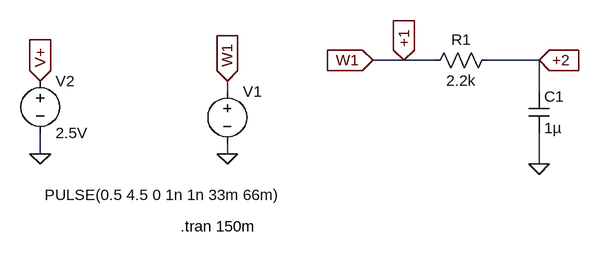
[diagram p0: schematic transient_response_RC_series.asc]
transient_response_RC_series.asc, the LTspice schematic file:
Version 4
SHEET 1 880 680
WIRE 128 112 80 112
WIRE 176 112 128 112
WIRE 336 112 256 112
WIRE -144 160 -144 144
WIRE 336 160 336 112
WIRE -432 256 -432 224
WIRE -144 256 -144 240
WIRE 336 272 336 224
FLAG -144 256 0
FLAG -144 144 W1
IOPIN -144 144 In
FLAG 80 112 W1
IOPIN 80 112 In
FLAG 128 112 +1
IOPIN 128 112 In
FLAG 336 112 +2
IOPIN 336 112 In
FLAG -432 256 0
FLAG -432 144 V+
IOPIN -432 144 In
FLAG 336 272 0
SYMBOL res 272 96 R90
WINDOW 0 0 56 VBottom 2
WINDOW 3 32 56 VTop 2
SYMATTR InstName R1
SYMATTR Value 2.2k
SYMBOL cap 320 160 R0
SYMATTR InstName C1
SYMATTR Value 1µ
SYMBOL voltage -144 144 R0
WINDOW 123 0 0 Left 0
WINDOW 39 0 0 Left 0
WINDOW 3 -281 175 Left 2
SYMATTR InstName V1
SYMATTR Value PULSE(0.5 4.5 0 1n 1n 33m 66m)
SYMBOL voltage -432 128 R0
WINDOW 123 0 0 Left 0
WINDOW 39 0 0 Left 0
SYMATTR InstName V2
SYMATTR Value 2.5V
TEXT -216 368 Left 2 !.tran 150m

The netlist it stands for:
* transient_response_RC_series.asc
R1 +2 +1 2.2k
C1 +2 0 1µ
V1 +1 0 PULSE(0.5 4.5 0 1n 1n 33m 66m)
V2 V+ 0 2.5V
.tran 150m
.backanno
.end